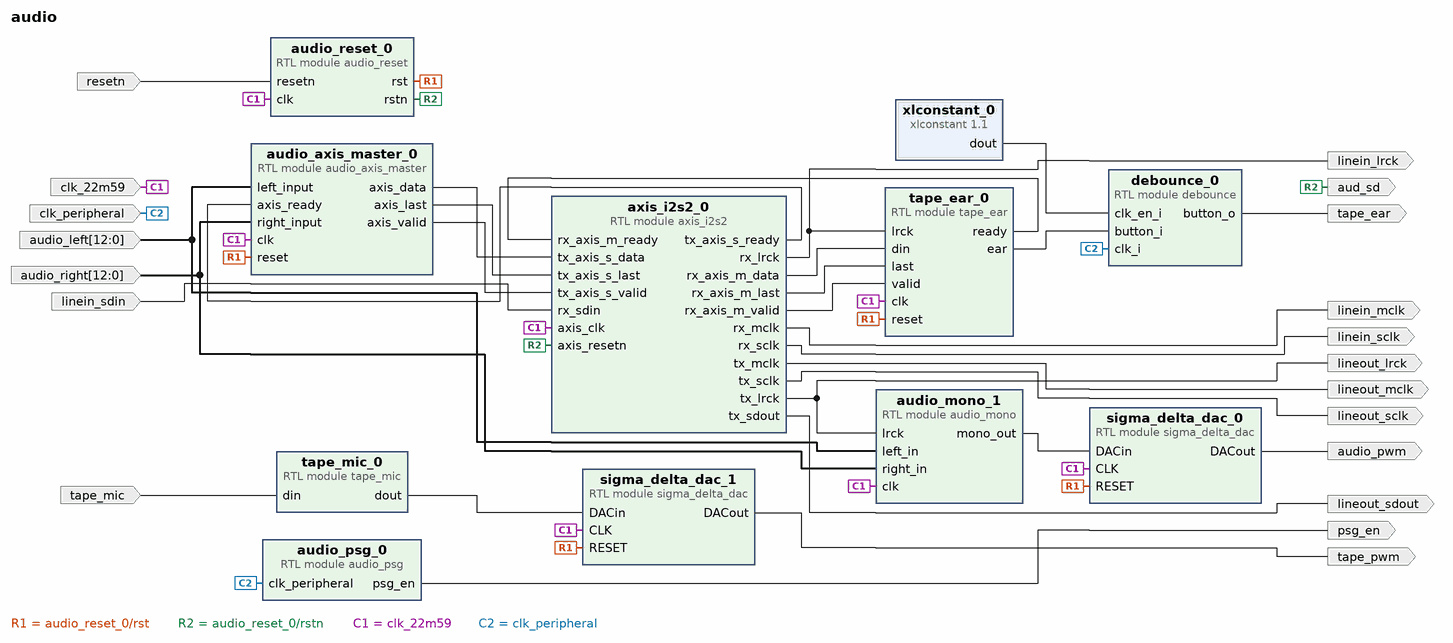
[diagram p0: block diagram of the top level]
# Vivado block design audio, xc7a100tcsg324-1, Vivado 2021.2.1
create_bd_design audio

create_bd_port -dir I -from 12 -to 0 audio_left
create_bd_port -dir O audio_pwm
create_bd_port -dir I -from 12 -to 0 audio_right
create_bd_port -dir O aud_sd
create_bd_port -dir I -type clk clk_22m59
set_property -dict {CONFIG.FREQ_HZ 22590010} [get_bd_ports clk_22m59]
create_bd_port -dir I -type clk clk_peripheral
set_property -dict {CONFIG.ASSOCIATED_RESET reset CONFIG.FREQ_HZ 28000000} [get_bd_ports clk_peripheral]
create_bd_port -dir O linein_lrck
create_bd_port -dir O linein_mclk
create_bd_port -dir O linein_sclk
create_bd_port -dir I linein_sdin
create_bd_port -dir O lineout_lrck
create_bd_port -dir O lineout_mclk
create_bd_port -dir O lineout_sclk
create_bd_port -dir O lineout_sdout
create_bd_port -dir O psg_en
create_bd_port -dir O tape_ear
create_bd_port -dir I tape_mic
create_bd_port -dir O tape_pwm
create_bd_port -dir I -type rst resetn

create_bd_cell -type module -reference sigma_delta_dac sigma_delta_dac_1
set_property -dict {CONFIG.MSBI 15} [get_bd_cells sigma_delta_dac_1]
create_bd_cell -type module -reference audio_psg audio_psg_0
create_bd_cell -type module -reference sigma_delta_dac sigma_delta_dac_0
set_property -dict {CONFIG.MSBI 12} [get_bd_cells sigma_delta_dac_0]
create_bd_cell -type module -reference axis_i2s2 axis_i2s2_0
create_bd_cell -type module -reference audio_axis_master audio_axis_master_0
set_property -dict {CONFIG.AUDIO_IN_DW 13} [get_bd_cells audio_axis_master_0]
create_bd_cell -type module -reference audio_mono audio_mono_1
set_property -dict {CONFIG.AUDIO_DW 13} [get_bd_cells audio_mono_1]
create_bd_cell -type module -reference tape_mic tape_mic_0
create_bd_cell -type module -reference debounce debounce_0
set_property -dict {CONFIG.COUNTER_SIZE 2} [get_bd_cells debounce_0]
create_bd_cell -type ip -vlnv xilinx.com:ip:xlconstant:1.1 xlconstant_0
create_bd_cell -type module -reference tape_ear tape_ear_0
set_property -dict {CONFIG.AUDIO_DW 32} [get_bd_cells tape_ear_0]
create_bd_cell -type module -reference audio_reset audio_reset_0

# ---- connections ----

connect_bd_net [get_bd_pins audio_axis_master_0/axis_data] [get_bd_pins axis_i2s2_0/tx_axis_s_data]
connect_bd_net [get_bd_pins audio_axis_master_0/axis_last] [get_bd_pins axis_i2s2_0/tx_axis_s_last]
connect_bd_net [get_bd_pins audio_axis_master_0/axis_valid] [get_bd_pins axis_i2s2_0/tx_axis_s_valid]
connect_bd_net [get_bd_ports audio_left] [get_bd_pins audio_axis_master_0/left_input] [get_bd_pins audio_mono_1/left_in]
connect_bd_net [get_bd_pins audio_mono_1/mono_out] [get_bd_pins sigma_delta_dac_0/DACin]
connect_bd_net [get_bd_pins audio_psg_0/psg_en] [get_bd_ports psg_en]
connect_bd_net [get_bd_pins audio_reset_0/rst] \
  [get_bd_pins sigma_delta_dac_1/RESET] [get_bd_pins sigma_delta_dac_0/RESET] [get_bd_pins audio_axis_master_0/reset] \
  [get_bd_pins tape_ear_0/reset]
connect_bd_net [get_bd_pins audio_reset_0/rstn] [get_bd_ports aud_sd] [get_bd_pins axis_i2s2_0/axis_resetn]
connect_bd_net [get_bd_ports audio_right] [get_bd_pins audio_axis_master_0/right_input] [get_bd_pins audio_mono_1/right_in]
connect_bd_net [get_bd_pins axis_i2s2_0/rx_axis_m_data] [get_bd_pins tape_ear_0/din]
connect_bd_net [get_bd_pins axis_i2s2_0/rx_axis_m_last] [get_bd_pins tape_ear_0/last]
connect_bd_net [get_bd_pins axis_i2s2_0/rx_axis_m_valid] [get_bd_pins tape_ear_0/valid]
connect_bd_net [get_bd_pins axis_i2s2_0/rx_lrck] [get_bd_ports linein_lrck] [get_bd_pins tape_ear_0/lrck]
connect_bd_net [get_bd_pins axis_i2s2_0/rx_mclk] [get_bd_ports linein_mclk]
connect_bd_net [get_bd_pins axis_i2s2_0/rx_sclk] [get_bd_ports linein_sclk]
connect_bd_net [get_bd_pins axis_i2s2_0/tx_axis_s_ready] [get_bd_pins audio_axis_master_0/axis_ready]
connect_bd_net [get_bd_pins axis_i2s2_0/tx_lrck] [get_bd_ports lineout_lrck] [get_bd_pins audio_mono_1/lrck]
connect_bd_net [get_bd_pins axis_i2s2_0/tx_mclk] [get_bd_ports lineout_mclk]
connect_bd_net [get_bd_pins axis_i2s2_0/tx_sclk] [get_bd_ports lineout_sclk]
connect_bd_net [get_bd_pins axis_i2s2_0/tx_sdout] [get_bd_ports lineout_sdout]
connect_bd_net [get_bd_ports clk_22m59] \
  [get_bd_pins sigma_delta_dac_1/CLK] [get_bd_pins sigma_delta_dac_0/CLK] [get_bd_pins axis_i2s2_0/axis_clk] \
  [get_bd_pins audio_axis_master_0/clk] [get_bd_pins audio_mono_1/clk] [get_bd_pins tape_ear_0/clk] \
  [get_bd_pins audio_reset_0/clk]
connect_bd_net [get_bd_ports clk_peripheral] [get_bd_pins audio_psg_0/clk_peripheral] [get_bd_pins debounce_0/clk_i]
connect_bd_net [get_bd_pins debounce_0/button_o] [get_bd_ports tape_ear]
connect_bd_net [get_bd_ports linein_sdin] [get_bd_pins axis_i2s2_0/rx_sdin]
connect_bd_net [get_bd_ports resetn] [get_bd_pins audio_reset_0/resetn]
connect_bd_net [get_bd_pins sigma_delta_dac_0/DACout] [get_bd_ports audio_pwm]
connect_bd_net [get_bd_pins sigma_delta_dac_1/DACout] [get_bd_ports tape_pwm]
connect_bd_net [get_bd_pins tape_ear_0/ear] [get_bd_pins debounce_0/button_i]
connect_bd_net [get_bd_pins tape_ear_0/ready] [get_bd_pins axis_i2s2_0/rx_axis_m_ready]
connect_bd_net [get_bd_pins tape_mic_0/dout] [get_bd_pins sigma_delta_dac_1/DACin]
connect_bd_net [get_bd_ports tape_mic] [get_bd_pins tape_mic_0/din]
connect_bd_net [get_bd_pins xlconstant_0/dout] [get_bd_pins debounce_0/clk_en_i]

validate_bd_design
save_bd_design
